# Altium schematic sheet Motherboard.SchDoc
size A; SheetNumber: 2; SheetTotal: 2
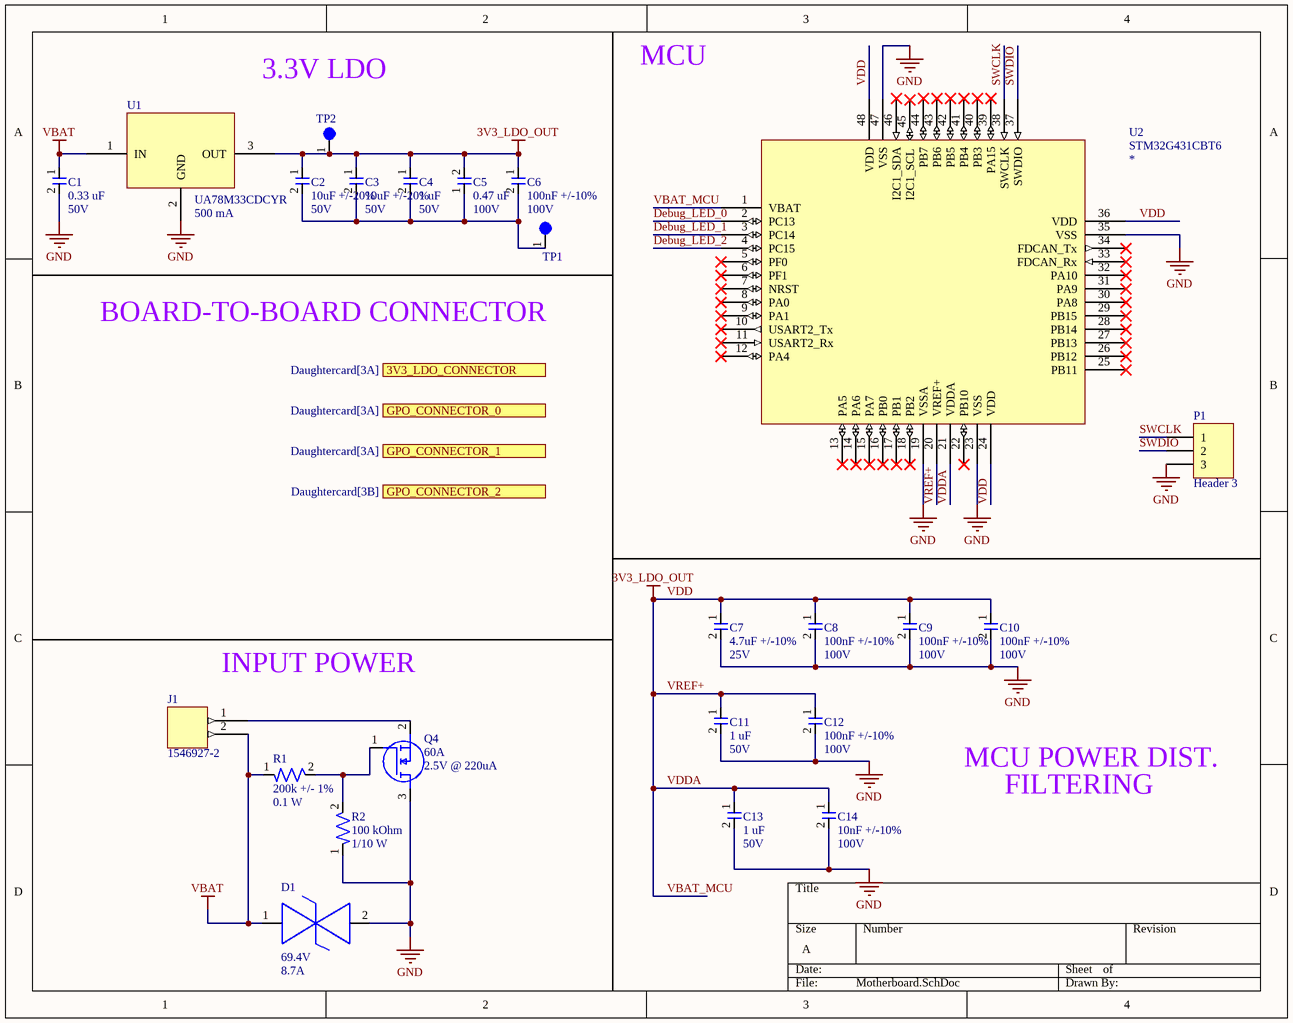
[diagram p0: Motherboard.SchDoc]

## Parts
C1  Capacitance: 0.33 uF  Voltage: 50V  [CAP-0603]  (hidden comment: CGA3E3X7R1H334K080AB)
C2  Capacitance: 10uF +/-20%  Voltage Rating: 50V  [CAP-1206]  (hidden comment: CL31B106KBHNNNE)
C3  Capacitance: 10uF +/-20%  Voltage Rating: 50V  [CAP-1206]  (hidden comment: CL31B106KBHNNNE)
C4  Capacitance: 1 uF  Voltage: 50V  [CAP-0603]  (hidden comment: UMK107AB7105KA-T)
C5  Capacitance: 0.47 uF  Voltage: 100V  [CAP-0805]  (hidden comment: KAM21KR72A474KL)
C6  Capacitance: 100nF +/-10%  Voltage Rating: 100V  [CAP-0603]  (hidden comment: CC0603KRX7R0BB104)
C7  Capacitance: 4.7uF +/-10%  Voltage Rating: 25V  [CAP-0603]  (hidden comment: TMK107BBJ475KA-T)
C8  Capacitance: 100nF +/-10%  Voltage Rating: 100V  [CAP-0603]  (hidden comment: CC0603KRX7R0BB104)
C9  Capacitance: 100nF +/-10%  Voltage Rating: 100V  [CAP-0603]  (hidden comment: CC0603KRX7R0BB104)
C10  Capacitance: 100nF +/-10%  Voltage Rating: 100V  [CAP-0603]  (hidden comment: CC0603KRX7R0BB104)
C11  Capacitance: 1 uF  Voltage: 50V  [CAP-0603]  (hidden comment: UMK107AB7105KA-T)
C12  Capacitance: 100nF +/-10%  Voltage Rating: 100V  [CAP-0603]  (hidden comment: CC0603KRX7R0BB104)
C13  Capacitance: 1 uF  Voltage: 50V  [CAP-0603]  (hidden comment: UMK107AB7105KA-T)
C14  Capacitance: 10nF +/-10%  Voltage Rating: 100V  [CAP-0402]  (hidden comment: CC0402KRX7R0BB103)
D1  Vclamp: 69.4V  Peak pulser current: 8.7A  [DO-214AA (SMBJ)]  (hidden comment: SMBJE43CAH)
J1  1546927-2  [CONN-1546927-2]
P1  Header 3  [HDR1X3]
Q4  Drain Current: 60A  Vgs: 2.5V @ 220uA  [NMOS-8PowerVDFN]  (hidden comment: TPH7R006PL,L1Q)
R1  Resistance: 200k +/- 1%  Power Rating: 0.1 W  [RES-0603]  (hidden comment: ERJ-3EKF2003V)
R2  Resistance: 100 kOhm  Power: 1/10 W  [RES-0603]  (hidden comment: RC0603FR-07100KL)
TP1  5003  [TEST-POINT-0001]  (value not drawn)
TP2  5003  [TEST-POINT-0001]  (value not drawn)
U1  UA78M33CDCYR  Current: 500 mA  [IC-SOT-223-4]
U2  STM32G431CBT6  [LQFP48-7x7mm]

## Ports
3V3_LDO_CONNECTOR (out, see Daughtercard[3A]), GPO_CONNECTOR_0 (out, see Daughtercard[3A]), GPO_CONNECTOR_1 (out, see Daughtercard[3A]), GPO_CONNECTOR_2 (out, see Daughtercard[3B])

## Nets
GND: C1.2 C7.2 C8.2 C9.2 C10.2 C11.2 C12.2 C13.2 C14.2 D1.2 P1.3 Q4.3(D) R2.1 U1.2(GND) U2.19(VSSA) U2.23(VSS) U2.35(VSS) U2.47(VSS)
VBAT: C1.1 D1.1 J1.2 R1.1 U1.1(IN)
VBAT_MCU: C2.1 C3.1 C4.1 C5.2 C6.1 C7.1 C8.1 C9.1 C10.1 C11.1 C12.1 C13.1 C14.1 TP2.1 U1.3(OUT) U2.1(VBAT) U2.20(VREF+) U2.21(VDDA) U2.24(VDD) U2.36(VDD) U2.48(VDD)  [also labelled 3V3_LDO_OUT, VDD, VDDA, VREF+]
Debug_LED_0: U2.2(PC13)
Debug_LED_1: U2.3(PC14)
Debug_LED_2: U2.4(PC15)
SWCLK: P1.1 U2.38(SWCLK)
SWDIO: P1.2 U2.37(SWDIO)
NetC2_2: C2.2 C3.2 C4.2 C5.1 C6.2 TP1.1
NetJ1_1: J1.1 Q4.2(S)
NetQ4_1: Q4.1(G) R1.2 R2.2

Not connected (* = marked no-connect by the designer): U2 5(PF0)* 6(PF1)* 7(NRST)* 8(PA0)* 9(PA1)* 10(USART2_Tx)* 11(USART2_Rx)* 12(PA4)* 13(PA5)* 14(PA6)* 15(PA7)* 16(PB0)* 17(PB1)* 18(PB2)* 22(PB10)* 25(PB11)* 26(PB12)* 27(PB13)* 28(PB14)* 29(PB15)* 30(PA8)* 31(PA9)* 32(PA10)* 33(FDCAN_Rx)* 34(FDCAN_Tx)* 39(PA15)* 40(PB3)* 41(PB4)* 42(PB5)* 43(PB6)* 44(PB7)* 45(I2C1_SCL)* 46(I2C1_SDA)*

## Notes on the sheet
- 3.3V LDO
- MCU
- BOARD-TO-BOARD CONNECTOR
- INPUT POWER
- MCU POWER DIST.
- FILTERING

## Library data of the parts
C1 = CAP-0.33uF-0001: 0.33 µF ±10% 50V Ceramic Capacitor X7R 0603 (1608 Metric); Manufacturer: TDK Corporation; Tolerance: +/- 10%; Manufacturer Part Number: CGA3E3X7R1H334K080AB; Temperature Coefficient: X7R
C2 C3 = CAP-10U-0001: 10 µF ±10% 50V Ceramic Capacitor X7R 1206 (3216 Metric); Manufacturer: Samsung Electro-Mechanics; Assembled?: no; Manufacturer Part Number: CL31B106KBHNNNE; Temperature Coefficient: X7R; Package Size: 1206
C4 C11 C13 = CAP-1U-0002: 1 µF ±10% 50V Ceramic Capacitor X7R 0603 (1608 Metric); Package Size: 0603
C5 = CAP-0.47U-0001: 0.47 µF ±10% 100V Ceramic Capacitor X7R 0805 (2012 Metric); Tolerance: +/- 10%; Assembled?: No; Temperature Coefficient: X7R; Package Size: 0805
C6 C8-C10 C12 = CAP-100N-0001: CAP CER 0.1UF 100V X7R 0603; Manufacturer: YAGEO; Assembled?: no; Manufacturer Part Number: CC0603KRX7R0BB104; Temperature Coefficient: X7R; Package Size: 0603
C7 = CAP-4.7U-0001: 4.7 µF ±10% 25V Ceramic Capacitor X5R 0603 (1608 Metric); Manufacturer: Taiyo Yuden; Assembled?: no; Manufacturer Part Number: TMK107BBJ475KA-T; Temperature Coefficient: X5R; Package Size: 0603
C14 = CAP-10N-0001: 10000 pF ±10% 100V Ceramic Capacitor X7R 0402 (1005 Metric); Manufacturer: YAGEO; Assembled?: no; Manufacturer Part Number: CC0402KRX7R0BB103; Temperature Coefficient: X7R; Package Size: 0402
D1 = DIO-69.4V-0001: 69.4V Clamp 8.7A Ipp Tvs Diode Surface Mount DO-214AA (SMBJ); Channels: Bidirectional; Breakdown VOltage: 47.8V; Reverse working maximum voltage: 43V; Package: DO-214AA (SMBJ)
J1 = CON-2POS-0003
P1 = Header 3: Header, 3-Pin; LatestRevisionDate: 17-Jul-2002; LatestRevisionNote: Re-released for DXP Platform.; Publisher: Altium Limited
Q4 = NMOS-60A-0001: N-Channel 60 V 60A (Tc) 81W (Tc) Surface Mount 8-SOP Advance (5x5); Vdss: 60V; Vgs(Max): 20V; Package: 8-PowerVDFN
R1 = RES-200K-0001: 200 kOhms ±1% 0.1W, 1/10W Chip Resistor 0603 (1608 Metric) Automotive AEC-Q200 Thick Film; Manufacturer: Panasonic Electronic Components; Assembled?: Yes; MFP: ERJ-3EKF2003V; Package SIze: 0603
R2 = RES-100K-0003: 100 kOhms ±1% 0.1W, 1/10W Chip Resistor 0603 (1608 Metric) Moisture Resistant Thick Film; Tolerance: +/- 1%; Assembled?: No; Package Size: 0603
TP1 TP2 = TEST-POINT-0001: Oranange PC Test Point, Miniature Phoisphor Bronze Silver Plating Through Hole Mounting Type
U1 = IC-LDO-3.3V-0002: Linear Voltage Regulator IC Positive Fixed 1 Output 500mA SOT-223-4; Vin: 25V; Vout: 3.3V; Package: SOT-223-4
U2 = IC-STM32G431CBT6-0001: ARM® Cortex®-M4F STM32G4 Microcontroller IC 32-Bit Single-Core 170MHz 128KB (128K x 8) FLASH 48-LQFP (7x7); Parameter 1: *